# EAGLE design Audio-Board (EAGLE 9.6.2)
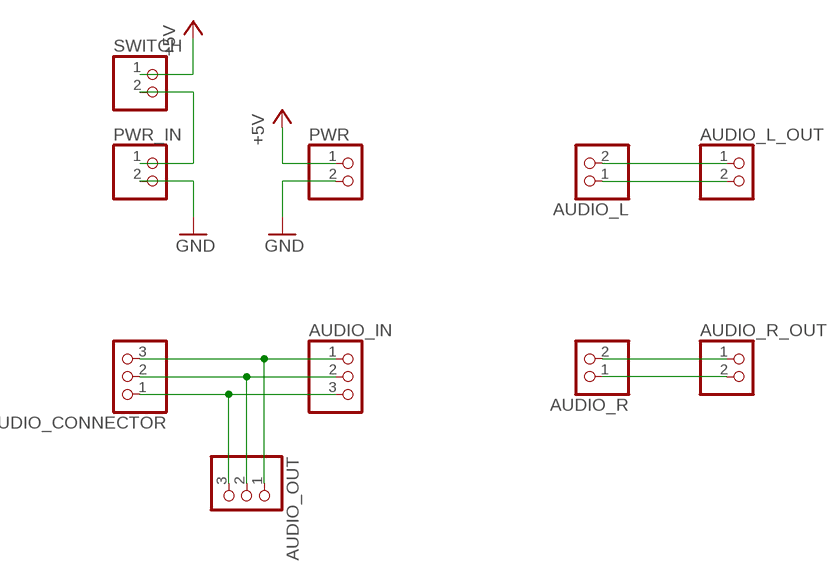
[diagram p0: schematic, sheet 1]

## Parts
AUDIO_CONNECTOR  PINHD-1X3  [1X03]
AUDIO_IN  PINHD-1X3  [1X03]
AUDIO_L  PINHD-1X2  [1X02]
AUDIO_L_OUT  PINHD-1X2/90  [1X02/90]
AUDIO_OUT  PINHD-1X3  [1X03]
AUDIO_R  PINHD-1X2  [1X02]
AUDIO_R_OUT  PINHD-1X2/90  [1X02/90]
PWR  PINHD-1X2  [1X02]
PWR_IN  PINHD-1X2/90  [1X02/90]
SWITCH  PINHD-1X2  [1X02]

## Nets
+5V: PWR.1 SWITCH.1
GND: PWR.2 PWR_IN.2
N$1: AUDIO_CONNECTOR.3 AUDIO_IN.1 AUDIO_OUT.1
N$2: AUDIO_CONNECTOR.2 AUDIO_IN.2 AUDIO_OUT.2
N$3: AUDIO_CONNECTOR.1 AUDIO_IN.3 AUDIO_OUT.3
N$4: AUDIO_L.1 AUDIO_L_OUT.2
N$5: AUDIO_L.2 AUDIO_L_OUT.1
N$6: AUDIO_R.2 AUDIO_R_OUT.1
N$7: AUDIO_R.1 AUDIO_R_OUT.2
N$8: PWR_IN.1 SWITCH.2

## Library data of the parts
AUDIO_CONNECTOR AUDIO_IN AUDIO_OUT = pinhead:PINHD-1X3: PIN HEADER
AUDIO_L AUDIO_L_OUT AUDIO_R AUDIO_R_OUT PWR PWR_IN SWITCH = pinhead:PINHD-1X2: PIN HEADER

## Board
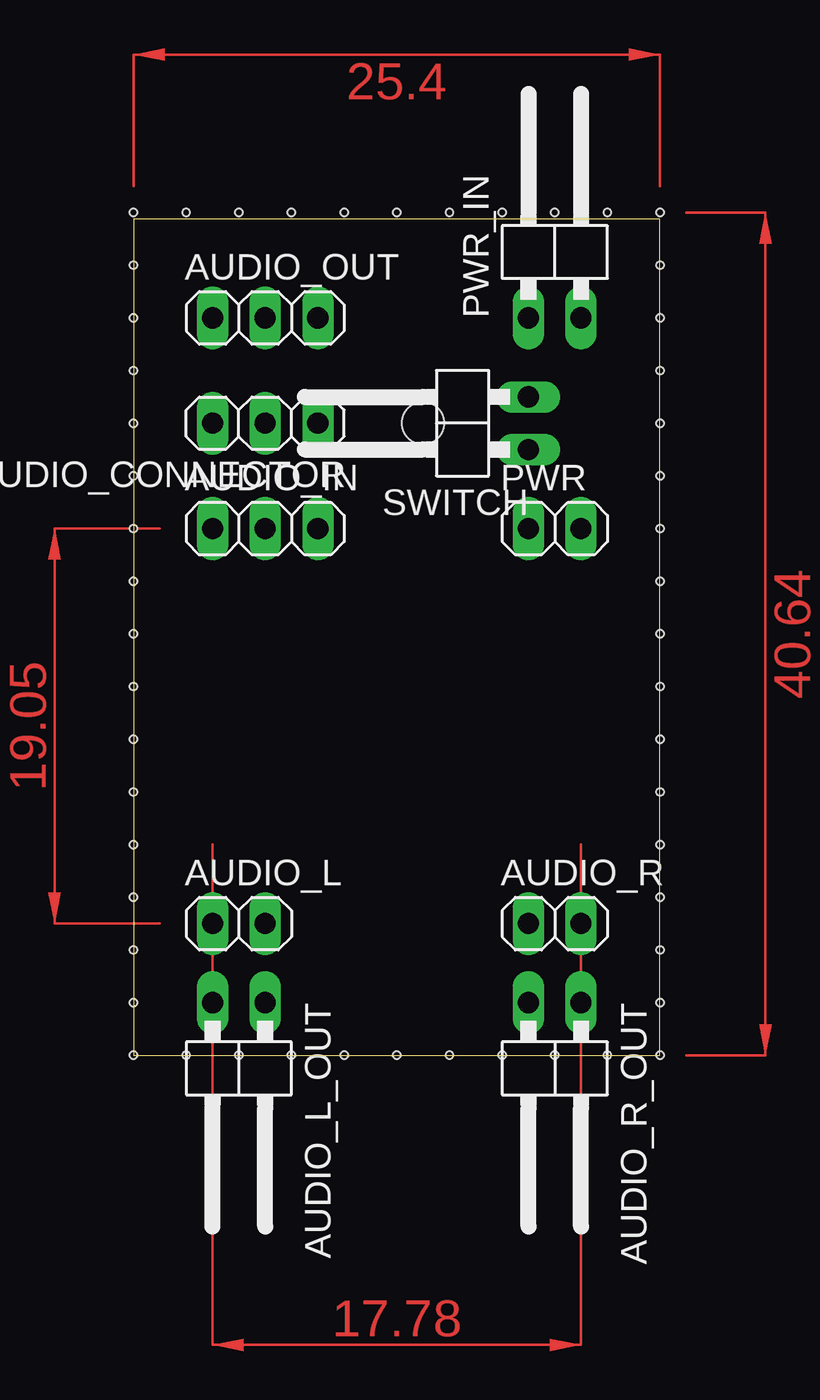
[diagram p1: board, top side]
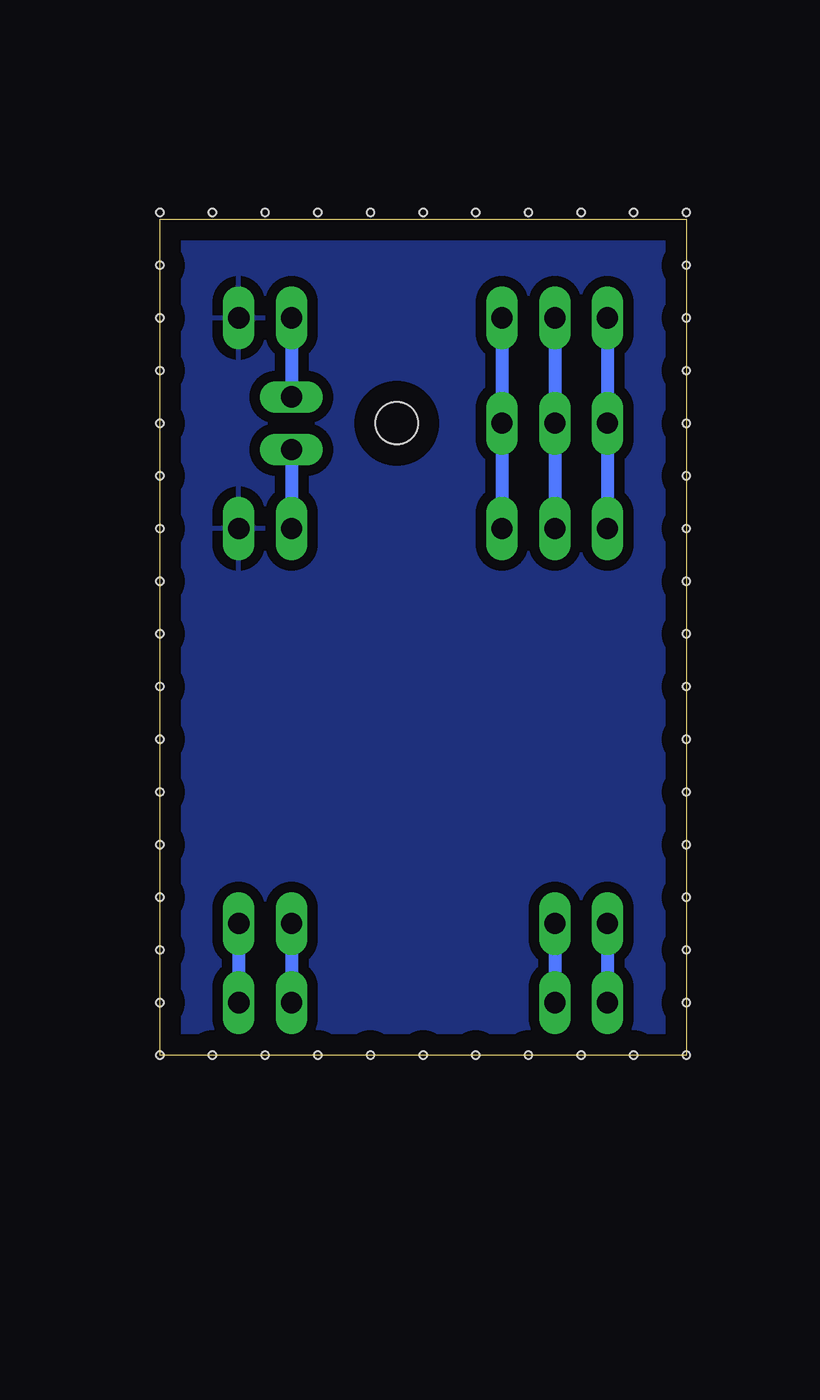
[diagram p2: board, bottom side, seen from below]

Size 25.38 x 40.31 mm. Coordinates in mm from the lower left corner, seen from the top.
Outline: 0,0 25.38,0 25.38,40.31 0,40.31 0,0
Copper layers (1*16): Top 0.035mm / dielectric 1.5mm / Bottom 0.035mm
Design rules "default2": minimum track width 25mil, minimum drill 0.35mm, track to track 20mil, track to pad 20mil, pad to pad 20mil, via to via 20mil, smd to smd 20mil, copper to edge 40mil, drill to drill 6mil, minimum pad ring 10mil, minimum via ring 8mil, stop-mask expansion 4mil, vias tented up to drill 0mil, thermal gap 20mil
Holes 0.35 mm at 0,40.64 2.54,40.64 5.08,40.64 7.62,40.64 10.16,40.64 12.7,40.64 15.24,40.64 17.78,40.64 20.32,40.64 22.86,40.64 25.4,40.64 25.4,38.1 25.4,35.56 25.4,33.02 25.4,30.48 25.4,27.94 25.4,20.32 25.4,22.86 25.4,25.4 25.4,12.7 25.4,15.24 25.4,17.78 25.4,5.08 25.4,7.62 25.4,10.16 0,33.02 0,35.56 0,38.1 0,25.4 0,27.94 0,30.48 0,17.78 0,20.32 0,22.86 0,10.16 0,12.7 0,15.24 0,2.54 0,5.08 0,7.62 5.08,0 2.54,0 0,0 12.7,0 10.16,0 7.62,0 15.24,0 17.78,0 20.32,0 25.4,2.54 25.4,0 22.86,0
Holes 2.03 mm at 13.97,30.48

### Footprints (pad centres in the part's own frame; a part is rotated, then mirrored left to right if it is on the bottom)
1X03 = drill 1.016 long: 1 -2.54,0; 2 0,0; 3 2.54,0
1X02 = drill 1.016 long: 1 -1.27,0; 2 1.27,0
1X02/90 = drill 1.016 long: 1 -1.27,-3.81; 2 1.27,-3.81

### Placement (x,y rotation side)
AUDIO_CONNECTOR  6.35,30.48 180 top
AUDIO_IN  6.35,25.4 0 top
AUDIO_L  5.08,6.35 0 top
AUDIO_L_OUT  5.08,-1.27 180 top
AUDIO_OUT  6.35,35.56 0 top
AUDIO_R  20.32,6.35 0 top
AUDIO_R_OUT  20.32,-1.27 180 top
PWR  20.32,25.4 0 top
PWR_IN  20.32,39.37 0 top
SWITCH  [1X02/90]  15.24,30.48 90 top

### Tracks (layer width: path | path; a pad name or v marks a point on that pad's centre or on a via)
+5V
  Bottom 0.635: SWITCH.1 PWR.1
GND
  pour Bottom: 0,40.64 25.4,40.64 25.4,0 0,0
N$1
  Bottom 0.635: AUDIO_OUT.1 AUDIO_CONNECTOR.3 AUDIO_IN.1
N$2
  Bottom 0.635: AUDIO_OUT.2 AUDIO_CONNECTOR.2 AUDIO_IN.2
N$3
  Bottom 0.635: AUDIO_OUT.3 AUDIO_CONNECTOR.1 AUDIO_IN.3
N$4
  Bottom 0.635: AUDIO_L.1 AUDIO_L_OUT.2
N$5
  Bottom 0.635: AUDIO_L.2 AUDIO_L_OUT.1
N$6
  Bottom 0.635: AUDIO_R.2 AUDIO_R_OUT.1
N$7
  Bottom 0.635: AUDIO_R.1 AUDIO_R_OUT.2
N$8
  Bottom 0.635: PWR_IN.1 SWITCH.2
(copper drawn outside any net)
  shapes: Top area x4